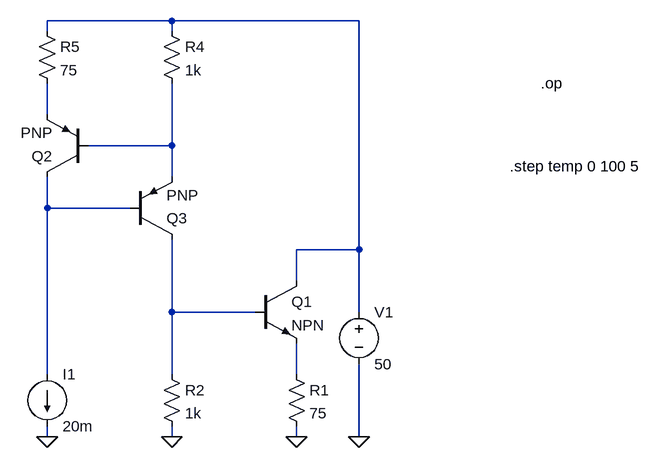
[diagram p0: schematic Draft2.asc]
Draft2.asc, the LTspice schematic file:
Version 4
SHEET 1 880 680
WIRE 64 -256 -128 -256
WIRE 352 -256 64 -256
WIRE -128 -240 -128 -256
WIRE 64 -240 64 -256
WIRE -128 -112 -128 -160
WIRE 64 -64 64 -160
WIRE 64 -64 -64 -64
WIRE 64 -16 64 -64
WIRE -128 32 -128 -16
WIRE 0 32 -128 32
WIRE 352 96 352 -256
WIRE 352 96 256 96
WIRE 256 144 256 96
WIRE 64 192 64 80
WIRE 192 192 64 192
WIRE 352 192 352 96
WIRE -128 288 -128 32
WIRE 64 288 64 192
WIRE 256 288 256 240
WIRE -128 384 -128 368
WIRE 64 384 64 368
WIRE 256 384 256 368
WIRE 352 384 352 272
FLAG 256 384 0
FLAG 352 384 0
FLAG 64 384 0
FLAG -128 384 0
SYMBOL npn 192 144 R0
SYMATTR InstName Q1
SYMBOL res 240 272 R0
SYMATTR InstName R1
SYMATTR Value 75
SYMBOL voltage 352 176 R0
WINDOW 123 0 0 Left 0
WINDOW 39 0 0 Left 0
SYMATTR InstName V1
SYMATTR Value 50
SYMBOL res 48 272 R0
SYMATTR InstName R2
SYMATTR Value 1k
SYMBOL pnp -64 -16 R180
SYMATTR InstName Q2
SYMBOL pnp 0 80 M180
SYMATTR InstName Q3
SYMBOL res 48 -256 R0
SYMATTR InstName R4
SYMATTR Value 1k
SYMBOL res -144 -256 R0
SYMATTR InstName R5
SYMATTR Value 75
SYMBOL current -128 288 R0
WINDOW 123 0 0 Left 0
WINDOW 39 0 0 Left 0
SYMATTR InstName I1
SYMATTR Value 20m
TEXT 632 -160 Left 2 !.op
TEXT 584 -32 Left 2 !.step temp 0 100 5

The netlist it stands for:
* Draft2.asc
Q1 N001 N005 N006 0 NPN
R1 N006 0 75
V1 N001 0 50
R2 N005 0 1k
Q2 N004 N003 N002 0 PNP
Q3 N005 N004 N003 0 PNP
R4 N001 N003 1k
R5 N001 N002 75
I1 N004 0 20m
.model NPN NPN
.model PNP PNP
.lib standard.bjt
.op
.step temp 0 100 5
.backanno
.end